# Altium schematic sheet power.SchDoc
size A3
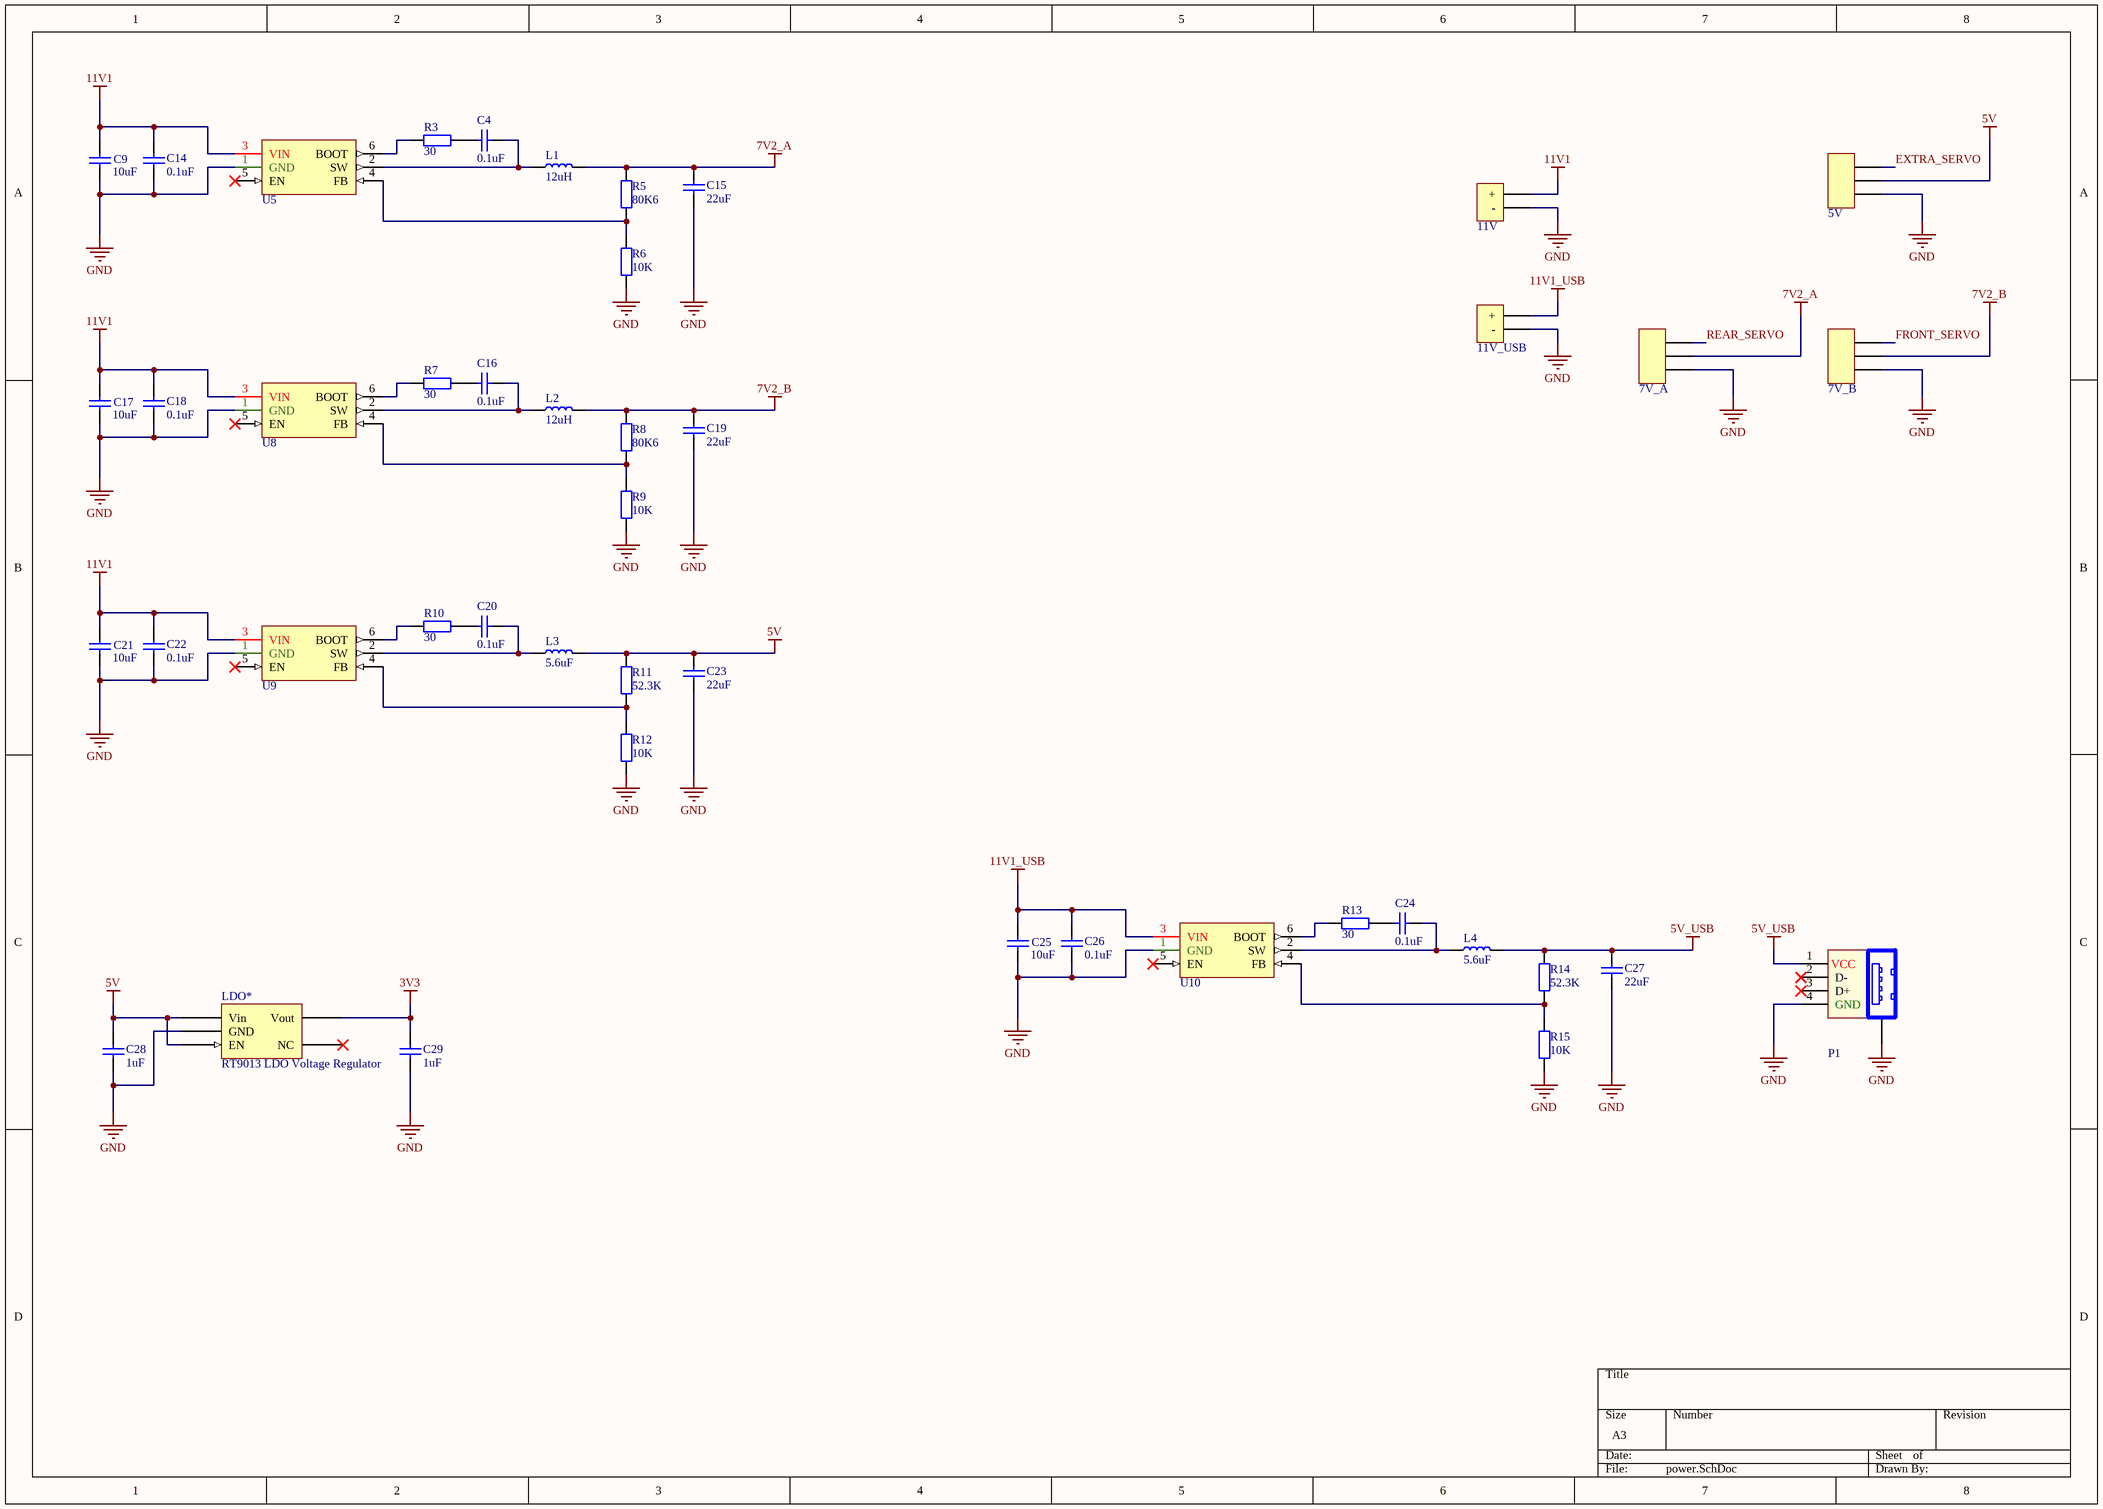
[diagram p0: power.SchDoc]

## Parts
5V  3-Pin HEADER  [3-Pin HEADER]  (value not drawn)
7V_A  3-Pin HEADER  [3-Pin HEADER]  (value not drawn)
7V_B  3-Pin HEADER  [3-Pin HEADER]  (value not drawn)
11V  T_PLUG  [T_plug]  (value not drawn)
11V_USB  T_PLUG  [T_plug]  (value not drawn)
C4  Capacitance: 0.1uF  [0805]  (hidden comment: C0805C104M5RACTU)
C9  Capacitance: 10uF  [0805]  (hidden comment: GRM21BR61E106MA73L)
C14  Capacitance: 0.1uF  [0805]  (hidden comment: C0805C104M5RACTU)
C15  Capacitance: 22uF  [1210]  (hidden comment: TMK325B7226KMHP)
C16  Capacitance: 0.1uF  [0805]  (hidden comment: C0805C104M5RACTU)
C17  Capacitance: 10uF  [0805]  (hidden comment: GRM21BR61E106MA73L)
C18  Capacitance: 0.1uF  [0805]  (hidden comment: C0805C104M5RACTU)
C19  Capacitance: 22uF  [1210]  (hidden comment: TMK325B7226KMHP)
C20  Capacitance: 0.1uF  [0805]  (hidden comment: C0805C104M5RACTU)
C21  Capacitance: 10uF  [0805]  (hidden comment: GRM21BR61E106MA73L)
C22  Capacitance: 0.1uF  [0805]  (hidden comment: C0805C104M5RACTU)
C23  Capacitance: 22uF  [1210]  (hidden comment: TMK325B7226KMHP)
C24  Capacitance: 0.1uF  [0805]  (hidden comment: C0805C104M5RACTU)
C25  Capacitance: 10uF  [0805]  (hidden comment: GRM21BR61E106MA73L)
C26  Capacitance: 0.1uF  [0805]  (hidden comment: C0805C104M5RACTU)
C27  Capacitance: 22uF  [1210]  (hidden comment: TMK325B7226KMHP)
C28  Capacitance: 1uF  [0805]  (hidden comment: VJ0805Y105KXQTW1BC)
C29  Capacitance: 1uF  [0805]  (hidden comment: VJ0805Y105KXQTW1BC)
L1  Inductance: 12uH  [SDR1307]  (hidden comment: SDR1307-120ML)
L2  Inductance: 12uH  [SDR1307]  (hidden comment: SDR1307-120ML)
L3  Inductance: 5.6uF  [SDR1307]  (hidden comment: SDR1307-5R6ML)
L4  Inductance: 5.6uF  [SDR1307]  (hidden comment: SDR1307-5R6ML)
LDO*  RT9013 LDO Voltage Regulator  [RT9013_SOT23]
P1  MC32593  [MC32593]  (value not drawn)
R3  Resistance: 30  [0603_RES]  (hidden comment: RC0603FR-0730RL)
R5  Resistance: 80K6  [0603_RES]  (hidden comment: CRCW060380K6FKEA)
R6  Resistance: 10K  [0603_RES]  (hidden comment: CRCW060310K0FKEA)
R7  Resistance: 30  [0603_RES]  (hidden comment: RC0603FR-0730RL)
R8  Resistance: 80K6  [0603_RES]  (hidden comment: CRCW060380K6FKEA)
R9  Resistance: 10K  [0603_RES]  (hidden comment: CRCW060310K0FKEA)
R10  Resistance: 30  [0603_RES]  (hidden comment: RC0603FR-0730RL)
R11  Resistance: 52.3K  [0603_RES]  (hidden comment: CRCW060352K3FKEA)
R12  Resistance: 10K  [0603_RES]  (hidden comment: CRCW060310K0FKEA)
R13  Resistance: 30  [0603_RES]  (hidden comment: RC0603FR-0730RL)
R14  Resistance: 52.3K  [0603_RES]  (hidden comment: CRCW060352K3FKEA)
R15  Resistance: 10K  [0603_RES]  (hidden comment: CRCW060310K0FKEA)
U5  TPS56339  [SOT-23-Thin-6]  (value not drawn)
U8  TPS56339  [SOT-23-Thin-6]  (value not drawn)
U9  TPS56339  [SOT-23-Thin-6]  (value not drawn)
U10  TPS56339  [SOT-23-Thin-6]  (value not drawn)

## Nets
3V3: C29.2 LDO*.Vout
5V: 5V.2 C23.2 C28.2 L3.2 LDO*.EN LDO*.Vin R11.2
5V_USB: C27.2 L4.2 P1.1(VCC) R14.2
7V2_A: 7V_A.2 C15.2 L1.2 R5.2
7V2_B: 7V_B.2 C19.2 L2.2 R8.2
11V1: 11V.1(+) C9.2 C14.2 C17.2 C18.2 C21.2 C22.2 U5.3(VIN) U8.3(VIN) U9.3(VIN)
11V1_USB: 11V_USB.1(+) C25.2 C26.2 U10.3(VIN)
GND: 5V.3 7V_A.3 7V_B.3 11V.2(-) 11V_USB.2(-) C9.1 C14.1 C15.1 C17.1 C18.1 C19.1 C21.1 C22.1 C23.1 C25.1 C26.1 C27.1 C28.1 C29.1 LDO*.GND P1.0(MNT/GND) P1.4(GND) R6.1 R9.1 R12.1 R15.1 U5.1(GND) U8.1(GND) U9.1(GND) U10.1(GND)
EXTRA_SERVO: 5V.1
FRONT_SERVO: 7V_B.1
REAR_SERVO: 7V_A.1
NetC4_1: C4.1 R3.2
NetC4_2: C4.2 L1.1 U5.2(SW)
NetC16_1: C16.1 R7.2
NetC16_2: C16.2 L2.1 U8.2(SW)
NetC20_1: C20.1 R10.2
NetC20_2: C20.2 L3.1 U9.2(SW)
NetC24_1: C24.1 R13.2
NetC24_2: C24.2 L4.1 U10.2(SW)
NetR3_1: R3.1 U5.6(BOOT)
NetR5_1: R5.1 R6.2 U5.4(FB)
NetR7_1: R7.1 U8.6(BOOT)
NetR8_1: R8.1 R9.2 U8.4(FB)
NetR10_1: R10.1 U9.6(BOOT)
NetR11_1: R11.1 R12.2 U9.4(FB)
NetR13_1: R13.1 U10.6(BOOT)
NetR14_1: R14.1 R15.2 U10.4(FB)

Not connected (* = marked no-connect by the designer): LDO* NC*; P1 2(D-)* 3(D+)*; U5 5(EN)*; U8 5(EN)*; U9 5(EN)*; U10 5(EN)*

## Library data of the parts
11V 11V_USB = T_PLUG: LiPo battery T plug connector
C4 C14 C16 C18 C20 C22 C24 C26 = C0805C104M5RACTU: Multilayer Ceramic Capacitors MLCC - SMD/SMT 50V 0.1uF X7R 0805 20%
C9 C17 C21 C25 = GRM21BR61E106MA73L: Multilayer Ceramic Capacitors MLCC - SMD/SMT 0805 10uF 25volts X5R 20%
C15 C19 C23 C27 = TMK325B7226KMHP: Multilayer Ceramic Capacitors MLCC - SMD/SMT 1210 25V 22uF 10% X7R AEC-Q200
C28 C29 = VJ0805Y105KXQTW1BC: SMD Multilayer Ceramic Capacitor, 0805 [2012 Metric], 1 µF, 10 V, ± 10%, X7R, VJ Series
L1 L2 = SDR1307-120ML: Fixed Inductors 12uH 20% SMD 1307
L3 L4 = SDR1307-5R6ML: Fixed Inductors 5.6uH 20% SMD 1307
LDO* = RT9013: LDO Voltage Regulator
P1 = MC32593: USB Connector, USB Type A, USB 2.0, Receptacle, 4 Ways, Through Hole Mount, Right Angle
R3 R7 R10 R13 = RC0603FR-0730RL: Thick Film Resistors - SMD 30 OHM 1%
R5 R8 = CRCW060380K6FKEA: Thick Film Resistors - SMD 1/10watt 80.6Kohms 1%
R6 R9 R12 R15 = CRCW060310K0FKEA: Thick Film Resistors - SMD 1/10watt 10Kohms 1%
R11 R14 = CRCW060352K3FKEA: Thick Film Resistors - SMD 1/10watt 52.3Kohms 1%
U5 U8-U10 = TPS56339: 4.5-V to 24-V Input, 3-A Output Synchronous Buck Converter